# Altium schematic sheet schematic-sac-xa-4s.schdoc
size A3; SheetNumber: 1; SheetTotal: 1
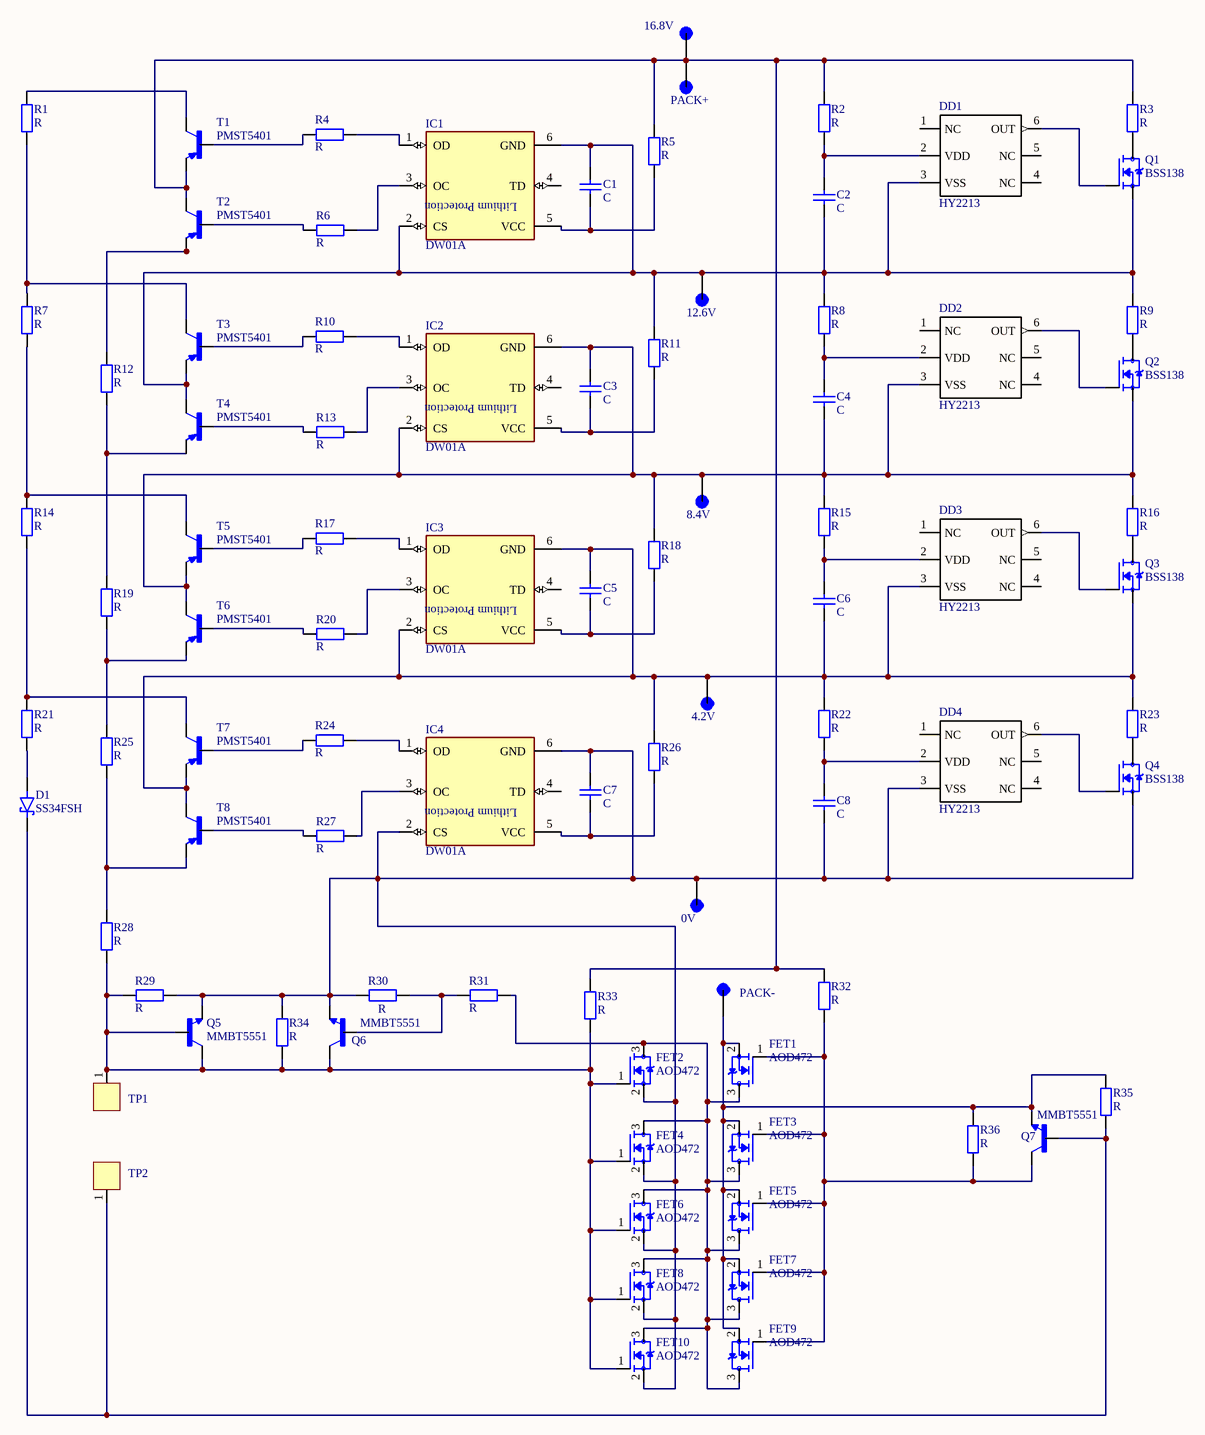
[diagram p0: schematic-sac-xa-4s.schdoc]

## Parts
0V  5003  [KEYSTONE_5003]  (value not drawn)
4.2V  5003  [KEYSTONE_5003]  (value not drawn)
8.4V  5003  [KEYSTONE_5003]  (value not drawn)
12.6V  5003  [KEYSTONE_5003]  (value not drawn)
16.8V  5003  [KEYSTONE_5003]  (value not drawn)
C1  C  [tu 0603]
C2  C  [tu 0603]
C3  C  [tu 0603]
C4  C  [tu 0603]
C5  C  [tu 0603]
C6  C  [tu 0603]
C7  C  [tu 0603]
C8  C  [tu 0603]
D1  SS34FSH  [SODFL4725X110N]
DD1  HY2213  [SOT23-6]
DD2  HY2213  [SOT23-6]
DD3  HY2213  [SOT23-6]
DD4  HY2213  [SOT23-6]
FET1  AOD472  [PCBComponent_1]
FET2  AOD472  [PCBComponent_1]
FET3  AOD472  [PCBComponent_1]
FET4  AOD472  [PCBComponent_1]
FET5  AOD472  [PCBComponent_1]
FET6  AOD472  [PCBComponent_1]
FET7  AOD472  [PCBComponent_1]
FET8  AOD472  [PCBComponent_1]
FET9  AOD472  [PCBComponent_1]
FET10  AOD472  [PCBComponent_1]
IC1  DW01A  [SOT23-6]
IC2  DW01A  [SOT23-6]
IC3  DW01A  [SOT23-6]
IC4  DW01A  [SOT23-6]
PACK+  5003  [KEYSTONE_5003]  (value not drawn)
PACK-  5003  [KEYSTONE_5003]  (value not drawn)
Q1  BSS138  [SOT95P240X111-3N]
Q2  BSS138  [SOT95P240X111-3N]
Q3  BSS138  [SOT95P240X111-3N]
Q4  BSS138  [SOT95P240X111-3N]
Q5  MMBT5551  [SOT23-3]
Q6  MMBT5551  [SOT23-3]
Q7  MMBT5551  [SOT23-3]
R1  R  [tro smd 0603]
R2  R  [tro smd 0603]
R3  R  [tro smd 0603]
R4  R  [tro smd 0603]
R5  R  [tro smd 0603]
R6  R  [tro smd 0603]
R7  R  [tro smd 0603]
R8  R  [tro smd 0603]
R9  R  [tro smd 0603]
R10  R  [tro smd 0603]
R11  R  [tro smd 0603]
R12  R  [tro smd 0603]
R13  R  [tro smd 0603]
R14  R  [tro smd 0603]
R15  R  [tro smd 0603]
R16  R  [tro smd 0603]
R17  R  [tro smd 0603]
R18  R  [tro smd 0603]
R19  R  [tro smd 0603]
R20  R  [tro smd 0603]
R21  R  [tro smd 0603]
R22  R  [tro smd 0603]
R23  R  [tro smd 0603]
R24  R  [tro smd 0603]
R25  R  [tro smd 0603]
R26  R  [tro smd 0603]
R27  R  [tro smd 0603]
R28  R  [tro smd 0603]
R29  R  [tro smd 0603]
R30  R  [tro smd 0603]
R31  R  [tro smd 0603]
R32  R  [tro smd 0603]
R33  R  [tro smd 0603]
R34  R  [tro smd 0603]
R35  R  [tro smd 0603]
R36  R  [tro smd 0603]
T1  PMST5401  [SOT323]
T2  PMST5401  [SOT323]
T3  PMST5401  [SOT323]
T4  PMST5401  [SOT323]
T5  PMST5401  [SOT323]
T6  PMST5401  [SOT323]
T7  PMST5401  [SOT323]
T8  PMST5401  [SOT323]
TP1  TP?  [TP]  (value not drawn)
TP2  TP?  [TP]  (value not drawn)

## Nets
Net0V_TP: 0V.TP C7.2 C8.1 DD4.3(VSS) FET2.2(S) FET4.2(S) FET6.2(S) FET8.2(S) FET10.2(S) IC4.2(CS) IC4.6(GND) Q4.2(S) Q5.2(E) Q6.2(E) R29.1 R30.2 R34.2
Net4.2V_TP: 4.2V.TP C5.2 C6.1 DD3.3(VSS) IC3.2(CS) IC3.6(GND) Q3.2(S) R22.1 R23.1 R26.1 T7.2(E) T8.3(C)
Net8.4V_TP: 8.4V.TP C3.2 C4.1 DD2.3(VSS) IC2.2(CS) IC2.6(GND) Q2.2(S) R15.1 R16.1 R18.1 T5.2(E) T6.3(C)
Net12.6V_TP: 12.6V.TP C1.2 C2.1 DD1.3(VSS) IC1.2(CS) IC1.6(GND) Q1.2(S) R8.1 R9.1 R11.1 T3.2(E) T4.3(C)
Net16.8V_TP: 16.8V.TP PACK+.TP R2.1 R3.1 R5.1 R32.1 R33.1 T1.2(E) T2.3(C)
NetC1_1: C1.1 IC1.5(VCC) R5.2
NetC2_2: C2.2 DD1.2(VDD) R2.2
NetC3_1: C3.1 IC2.5(VCC) R11.2
NetC4_2: C4.2 DD2.2(VDD) R8.2
NetC5_1: C5.1 IC3.5(VCC) R18.2
NetC6_2: C6.2 DD3.2(VDD) R15.2
NetC7_1: C7.1 IC4.5(VCC) R26.2
NetC8_2: C8.2 DD4.2(VDD) R22.2
NetD1_A: D1.A R21.1
NetD1_C: D1.C(K) Q7.1(B) R35.2 TP2.1
NetDD1_6: DD1.6(OUT) Q1.1(G)
NetDD2_6: DD2.6(OUT) Q2.1(G)
NetDD3_6: DD3.6(OUT) Q3.1(G)
NetDD4_6: DD4.6(OUT) Q4.1(G)
NetFET1_1: FET1.1(G) FET3.1(G) FET5.1(G) FET7.1(G) FET9.1(G) Q7.3(C) R32.2 R36.2
NetFET1_2: FET1.2(S) FET3.2(S) FET5.2(S) FET7.2(S) FET9.2(S) PACK-.TP Q7.2(E) R35.1 R36.1
NetFET1_3: FET1.3(D) FET2.3(D) FET3.3(D) FET4.3(D) FET5.3(D) FET6.3(D) FET7.3(D) FET8.3(D) FET9.3(D) FET10.3(D) R31.1
NetFET2_1: FET2.1(G) FET4.1(G) FET6.1(G) FET8.1(G) FET10.1(G) Q5.1(B) Q5.3(C) Q6.3(C) R28.1 R29.2 R33.2 R34.1 TP1.1
NetIC1_1: IC1.1(OD) R4.1
NetIC1_3: IC1.3(OC) R6.1
NetIC2_1: IC2.1(OD) R10.1
NetIC2_3: IC2.3(OC) R13.1
NetIC3_1: IC3.1(OD) R17.1
NetIC3_3: IC3.3(OC) R20.1
NetIC4_1: IC4.1(OD) R24.1
NetIC4_3: IC4.3(OC) R27.1
NetQ1_3: Q1.3(D) R3.2
NetQ2_3: Q2.3(D) R9.2
NetQ3_3: Q3.3(D) R16.2
NetQ4_3: Q4.3(D) R23.2
NetQ6_1: Q6.1(B) R30.1 R31.2
NetR1_1: R1.1 R7.2 T3.3(C)
NetR1_2: R1.2 T1.3(C)
NetR4_2: R4.2 T1.1(B)
NetR6_2: R6.2 T2.1(B)
NetR7_1: R7.1 R14.2 T5.3(C)
NetR10_2: R10.2 T3.1(B)
NetR12_1: R12.1 R19.2 T4.2(E)
NetR12_2: R12.2 T2.2(E)
NetR13_2: R13.2 T4.1(B)
NetR14_1: R14.1 R21.2 T7.3(C)
NetR17_2: R17.2 T5.1(B)
NetR19_1: R19.1 R25.2 T6.2(E)
NetR20_2: R20.2 T6.1(B)
NetR24_2: R24.2 T7.1(B)
NetR25_1: R25.1 R28.2 T8.2(E)
NetR27_2: R27.2 T8.1(B)

Not connected (* = marked no-connect by the designer): DD1 1(NC) 4(NC) 5(NC); DD2 1(NC) 4(NC) 5(NC); DD3 1(NC) 4(NC) 5(NC); DD4 1(NC) 4(NC) 5(NC); IC1 4(TD); IC2 4(TD); IC3 4(TD); IC4 4(TD)

## Notes on the sheet
- (in symbol DW01A) Lithium Protection

## Library data of the parts
0V 4.2V 8.4V 12.6V 16.8V PACK+ PACK- = 5003: MF: {'manufacturer': u'Keystone Electronics'}; Package: None; MP: 5003; Value: *; Availability: Unavailable; Price: None
C1-C8 = Tu 0603 105 50V 10%: Dán; Don_Vi: Con; So_Chan: 2; Ten_Linh_Kien: Tụ 0603 105-1uF 50V 10%; Ma_Hang: MH004569; Chung_Loai: Dán; Kieu_Chan: *
D1 = SS34FSH: 3A, 40V, Schottky Rectifier; MF: Taiwan Semiconductor; SnapEDA_Link: https://www.snapeda.com/parts/SS34FSH/Taiwan+Semiconductor/view-part/?ref=snap; Package: SOD-128-2 Taiwan Semiconductor; Value: *; MP: SS34FSH; Check_prices: https://www.snapeda.com/parts/SS34FSH/Taiwan+Semiconductor/view-part/?ref=eda; Availability: In Stock; Price: None
DD1-DD4 = HY2213: 1 Cell Li-ion/Polymer Battery Charge Balance IC
IC1-IC4 = DW01A: One Cell Lithium-ion/Polymer Battery Protection IC; MF: Fortune Semiconductor; Value: *; SnapEDA_Link: https://www.snapeda.com/parts/DW01A/Fortune+Semiconductor/view-part/?ref=snap; Availability: Not in stock; Price: None; Package: SOT-23-6 Fortune Semiconductor; Check_prices: https://www.snapeda.com/parts/DW01A/Fortune+Semiconductor/view-part/?ref=eda; MP: DW01A
Q1-Q4 = BSS138: N-Channel 50V 220mA (Ta) 360mW (Ta) Surface Mount SOT-23-3; MF: ON Semiconductor; MP: BSS138; Price: None; SnapEDA_Link: https://www.snapeda.com/parts/BSS138/ON%20Semiconductor/view-part/4794929/?ref=snap; Availability: Good; Purchase-URL: https://pricing.snapeda.com/search/part/BSS138/?ref=eda; Value: *; Check_prices: https://www.snapeda.com/parts/BSS138/ON%20Semiconductor/view-part/4794929/?ref=eda; Package: SOT-23 ON Semiconductor
Q5-Q7 = MMBT5551: Bipolar _BJT_ Transistor NPN 160V 600mA 225mW Surface Mount SOT-23-3 _TO-236_; MF: ON Semiconductor; Price: None; SnapEDA_Link: https://www.snapeda.com/parts/MMBT5551/ON%20Semiconductor/view-part/2760073/?ref=snap; Availability: Unavailable; Value: *; MP: MMBT5551; Package: SOT-23-3 MCC
R1-R36 = Tro 0603 5% 100R: Dán; Don_Vi: Con; So_Chan: 2; Ten_Linh_Kien: Trở 0603 5% 100R; Ma_Hang: MH006315; Chung_Loai: Dán; Kieu_Chan: *
T1-T8 = PMST5401: <p> <author>AAL Eindhoven MK</author><hr><p> <img src="http://www.nxp.com/img/NXP_logo.png">; Package: None; Price: None; Value: *; MP: PMST5401; Availability: Unavailable